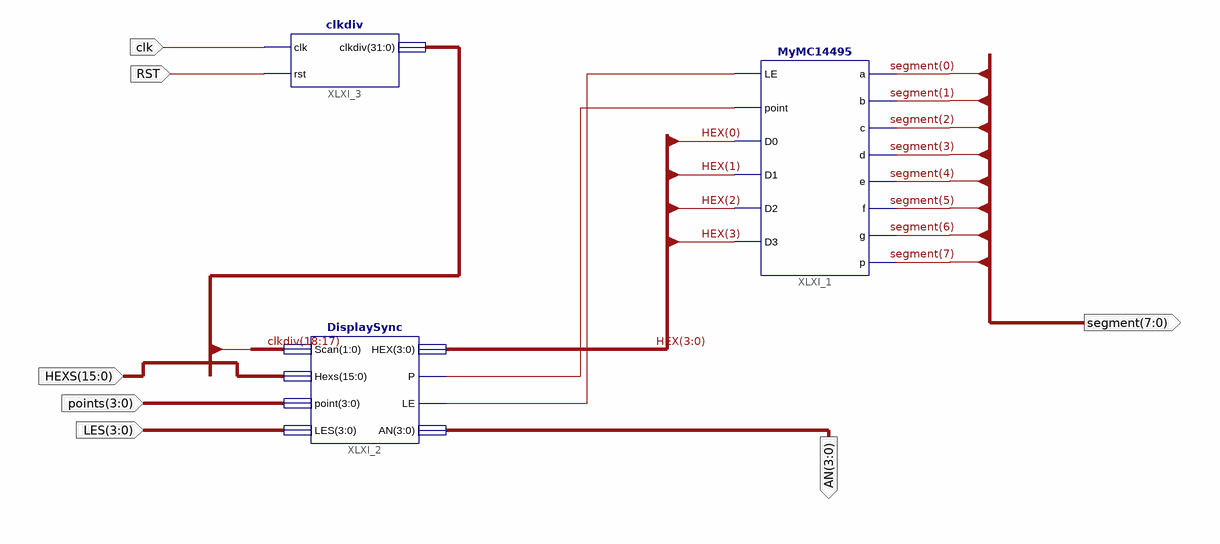
[diagram p0: schematic sheet 1]
// Xilinx ISE schematic disp_num.sch (kintex7) as structural Verilog: 3 symbols, 7 ports
module disp_num (
  input  clk,
  input  RST,
  input  [3:0] points,
  input  [3:0] LES,
  input  [15:0] HEXS,
  output [3:0] AN,
  output [7:0] segment
);

  wire XLXN_28, XLXN_29;
  wire [3:0] HEX;
  wire [31:0] clkdiv;

  MyMC14495 XLXI_1 (
    .LE(XLXN_28), .point(XLXN_29), .D0(HEX[0]), .D1(HEX[1]), .D2(HEX[2]), .D3(HEX[3]), .a(segment[0]),
    .b(segment[1]), .c(segment[2]), .d(segment[3]), .e(segment[4]), .f(segment[5]), .g(segment[6]),
    .p(segment[7]));
  DisplaySync XLXI_2 (
    .Scan(clkdiv[18:17]), .Hexs(HEXS), .point(points), .LES(LES), .HEX(HEX), .P(XLXN_29), .LE(XLXN_28),
    .AN(AN));
  clkdiv XLXI_3 (.clk(clk), .rst(RST), .clkdiv(clkdiv));
endmodule
